# Altium schematic sheet Network.SchDoc
size A3; SheetNumber: 6; SheetTotal: 7
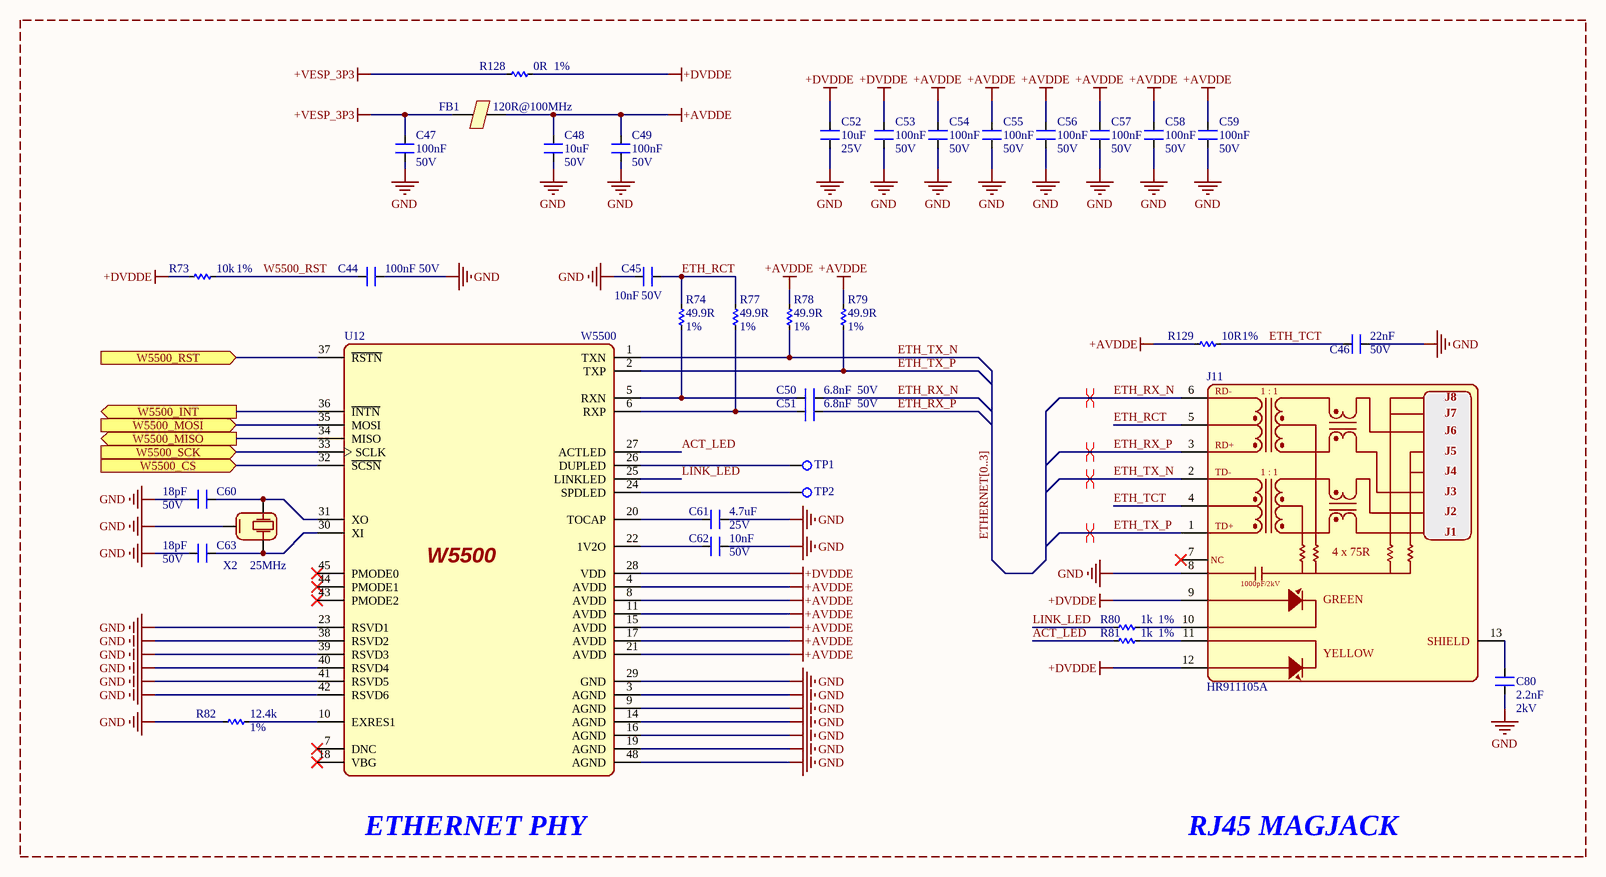
[diagram p0: Network.SchDoc]

## Parts
C44  Rating: 50V  [CAP_SMD_0603]  (hidden comment: 100nF)
C45  Rating: 50V  [CAP_SMD_0603]  (hidden comment: 10nF)
C46  Rating: 50V  [CAP_SMD_0603]  (hidden comment: 22nF)
C47  Rating: 50V  [CAP_SMD_0603]  (hidden comment: 100nF)
C48  Rating: 50V  [CAP_SMD_0603]  (hidden comment: 10uF)
C49  Rating: 50V  [CAP_SMD_0603]  (hidden comment: 100nF)
C50  Rating: 50V  [CAP_SMD_0603]  (hidden comment: 6.8nF)
C51  Rating: 50V  [CAP_SMD_0603]  (hidden comment: 6.8nF)
C52  Rating: 25V  [CAP_SMD_0603]  (hidden comment: 10uF)
C53  Rating: 50V  [CAP_SMD_0603]  (hidden comment: 100nF)
C54  Rating: 50V  [CAP_SMD_0603]  (hidden comment: 100nF)
C55  Rating: 50V  [CAP_SMD_0603]  (hidden comment: 100nF)
C56  Rating: 50V  [CAP_SMD_0603]  (hidden comment: 100nF)
C57  Rating: 50V  [CAP_SMD_0603]  (hidden comment: 100nF)
C58  Rating: 50V  [CAP_SMD_0603]  (hidden comment: 100nF)
C59  Rating: 50V  [CAP_SMD_0603]  (hidden comment: 100nF)
C60  Rating: 50V  [CAP_SMD_0603]  (hidden comment: 18pF)
C61  Rating: 25V  [CAP_SMD_0603]  (hidden comment: 4.7uF)
C62  Rating: 50V  [CAP_SMD_0603]  (hidden comment: 10nF)
C63  Rating: 50V  [CAP_SMD_0603]  (hidden comment: 18pF)
C80  Rating: 2kV  [CAP_SMD_1206]  (hidden comment: 2.2nF)
FB1  120R@100MHz  [FER 0805/2012]
J11  HR911105A  [HR911105A]
R73  Tolerance: 1%  [RES_SMD_0603]  (hidden comment: 10k)
R74  Tolerance: 1%  [RES_SMD_0603]  (hidden comment: 49.9R)
R77  Tolerance: 1%  [RES_SMD_0603]  (hidden comment: 49.9R)
R78  Tolerance: 1%  [RES_SMD_0603]  (hidden comment: 49.9R)
R79  Tolerance: 1%  [RES_SMD_0603]  (hidden comment: 49.9R)
R80  Tolerance: 1%  [RES_SMD_0603]  (hidden comment: 1k)
R81  Tolerance: 1%  [RES_SMD_0603]  (hidden comment: 1k)
R82  Tolerance: 1%  [RES_SMD_0603]  (hidden comment: 12.4k)
R128  Tolerance: 1%  [RES_SMD_0603]  (hidden comment: 0R)
R129  Tolerance: 1%  [RES_SMD_0603]  (hidden comment: 10R)
TP1  Test_Point  [PAD-SMD-D1.0]  (value not drawn)
TP2  Test_Point  [PAD-SMD-D1.0]  (value not drawn)
U12  W5500  [LQFP-48(7x7)]
X2  25MHz  [XT4-SMD]

## Ports
W5500_CS (in, see Architecture[6A]), W5500_INT (out, see Architecture[6A]), W5500_MISO (out, see Architecture[6A]), W5500_MOSI (in, see Architecture[6A]), W5500_RST (in, see Architecture[6A]), W5500_SCK (in, see Architecture[6A])

## Nets
+AVDDE: C48.1 C49.1 C54.1 C55.1 C56.1 C57.1 C58.1 C59.1 FB1.2 R78.2 R79.2 R129.1 U12.4(AVDD) U12.8(AVDD) U12.11(AVDD) U12.15(AVDD) U12.17(AVDD) U12.21(AVDD)
+DVDDE: C52.1 C53.1 J11.9 J11.12 R73.1 R128.2 U12.28(VDD)
+VESP_3P3: C47.1 FB1.1 R128.1
GND: C44.1 C45.2 C46.1 C47.2 C48.2 C49.2 C52.2 C53.2 C54.2 C55.2 C56.2 C57.2 C58.2 C59.2 C60.2 C61.1 C62.1 C63.2 C80.2 J11.8 R82.2 U12.3(AGND) U12.9(AGND) U12.14(AGND) U12.16(AGND) U12.19(AGND) U12.23(RSVD1) U12.29(GND) U12.38(RSVD2) U12.39(RSVD3) U12.40(RSVD4) U12.41(RSVD5) U12.42(RSVD6) U12.48(AGND) X2.2,4(GND)
ACT_LED: R81.2 U12.27(ACTLED)
ETH_RCT: C45.1 J11.5 R74.2 R77.2
ETH_RX_N: C50.1 J11.6
ETH_RX_P: C51.1 J11.3
ETH_TCT: C46.2 J11.4 R129.2
ETH_TX_N: J11.2 R78.1 U12.1(TXN)
ETH_TX_P: J11.1 R79.1 U12.2(TXP)
LINK_LED: R80.2 U12.25(LINKLED)
W5500_CS: U12.32(~{SCSN}) ; port W5500_CS
W5500_INT: U12.36(~{INTN}) ; port W5500_INT
W5500_MISO: U12.34(MISO) ; port W5500_MISO
W5500_MOSI: U12.35(MOSI) ; port W5500_MOSI
W5500_RST: C44.2 R73.2
W5500_RST: U12.37(~{RSTN}) ; port W5500_RST  [a separate net that carries the same name]
W5500_SCK: U12.33(SCLK) ; port W5500_SCK
NetC50_2: C50.2 R74.1 U12.5(RXN)
NetC51_2: C51.2 R77.1 U12.6(RXP)
NetC60_1: C60.1 U12.31(XO) X2.1(XTAL)
NetC61_2: C61.2 U12.20(TOCAP)
NetC62_2: C62.2 U12.22(1V2O)
NetC63_1: C63.1 U12.30(XI) X2.3(XTAL)
NetC80_1: C80.1 J11.13(SHIELD)
NetJ11_10: J11.10 R80.1
NetJ11_11: J11.11 R81.1
NetR82_1: R82.1 U12.10(EXRES1)
NetTP1_1: TP1.1 U12.26(DUPLED)
NetTP2_1: TP2.1 U12.24(SPDLED)

Not connected (* = marked no-connect by the designer): J11 7(NC)*; U12 7(DNC)* 18(VBG)* 43(PMODE2)* 44(PMODE1)* 45(PMODE0)*

## Buses and harness runs
bus ETHERNET[0..3]

## Layout directives
differential pair; differential pair class ETH 100R: ETH_RX_N, ETH_RX_P, ETH_TX_N, ETH_TX_P

## Notes on the sheet
- (near U12) ETHERNET PHY
- RJ45 MAGJACK
- (in symbol RJ45_10/100) RD-; 1 : 1; J8; J7; J6; RD+; J5; TD-; J4; J3; J2; TD+; J1; 4 x 75R; 1000pF/2kV; GREEN; YELLOW

## Library data of the parts
C44-C63 C80 = CN: PN: *; LCSC: *
  C44 C47 C49 C53-C59: Value: 100nF
  C45 C62: Value: 10nF
  C46: Value: 22nF
  C48 C52: Value: 10uF
  C50 C51: Value: 6.8nF
  C60 C63: Value: 18pF
  C61: Value: 4.7uF
  C80: Value: 2.2nF
FB1 = FERRITE BEAD: PN: CBW201209U121T; LCSC: C139186; Value: 120R@100MHz
J11 = RJ45_10/100: PN: HR911105A; LCSC: C12074; Value: HR911105A
R73 R74 R77-R82 R128 R129 = Res-SMD: Resistor; PN: *; LCSC: *
  R73: Value: 10k
  R74 R77-R79: Value: 49.9R
  R80 R81: Value: 1k
  R82: Value: 12.4k
  R128: Value: 0R
  R129: Value: 10R
U12 = W5500: -40℃~+85℃ 10BASE-T、100BASE-TX 3.3V 32KB 8 SPI SPI Yes LQFP-48(7x7) Ethernet Controllers ROHS; PN: W5500; LCSC: C32843; Value: W5500
X2 = XT4: Crystal, 16 MHz, -30 to 85 degC, 3.2 x 2.5 x 0.9 mm SMD; PN: *; LCSC: *; Value: 25MHz